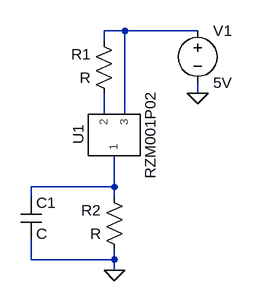
[diagram p0: schematic switch off protection.asc]
switch off protection.asc, the LTspice schematic file:
Version 4
SHEET 1 880 680
WIRE 224 0 192 0
WIRE 336 0 224 0
WIRE 192 16 192 0
WIRE 336 96 336 80
WIRE 192 128 192 96
WIRE 224 128 224 0
WIRE 208 240 208 192
WIRE 208 240 80 240
WIRE 80 256 80 240
WIRE 208 256 208 240
WIRE 80 352 80 320
WIRE 208 352 208 336
WIRE 208 352 80 352
WIRE 208 368 208 352
FLAG 208 368 0
FLAG 336 96 0
SYMBOL AutoGenerated\\RZM001P02 208 160 R270
SYMATTR InstName U1
SYMBOL res 208 112 R180
WINDOW 0 36 76 Left 2
WINDOW 3 36 40 Left 2
SYMATTR InstName R1
SYMBOL res 224 352 R180
WINDOW 0 36 76 Left 2
WINDOW 3 36 40 Left 2
SYMATTR InstName R2
SYMBOL cap 64 256 R0
SYMATTR InstName C1
SYMBOL voltage 336 -16 R0
WINDOW 123 0 0 Left 0
WINDOW 39 0 0 Left 0
SYMATTR InstName V1
SYMATTR Value 5V

The netlist it stands for:
* switch off protection.asc
XU1 N003 N002 N001 RZM001P02  ; pins 1 2 3
R1 N002 N001 R
R2 0 N003 R
C1 N003 0 C
V1 N001 0 5V
.lib D:\Projekte\ELController\ltspice model\rzm001p02_spice\rzm001p02.lib
.backanno
.end